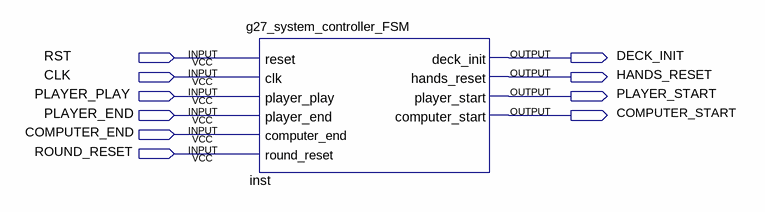
[diagram p0: schematic sheet]
// Quartus schematic g27_system_controller_schematic.bdf as structural Verilog: 1 symbols, 10 pins
module g27_system_controller_schematic (
  input  RST,
  input  CLK,
  input  PLAYER_PLAY,
  input  PLAYER_END,
  input  COMPUTER_END,
  input  ROUND_RESET,
  output DECK_INIT,
  output HANDS_RESET,
  output PLAYER_START,
  output COMPUTER_START
);

  g27_system_controller_FSM inst (
    .reset(RST), .clk(CLK), .player_play(PLAYER_PLAY), .player_end(PLAYER_END), .computer_end(COMPUTER_END),
    .round_reset(ROUND_RESET), .deck_init(DECK_INIT), .hands_reset(HANDS_RESET), .player_start(PLAYER_START),
    .computer_start(COMPUTER_START));
endmodule
